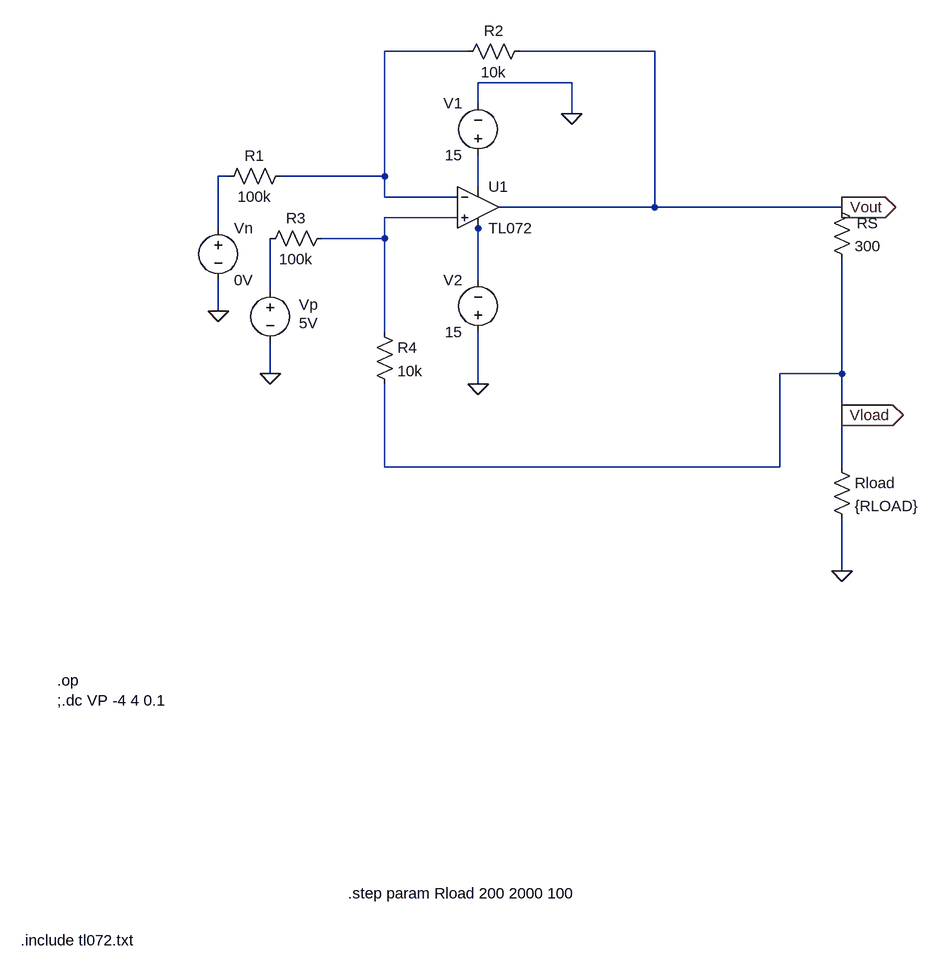
[diagram p0: schematic Tek_projekat.asc]
Tek_projekat.asc, the LTspice schematic file:
Version 4.1
SHEET 1 1220 1176
WIRE 432 -272 304 -272
WIRE 720 -272 512 -272
WIRE 592 -224 448 -224
WIRE 448 -192 448 -224
WIRE 592 -176 592 -224
WIRE 64 -80 48 -80
WIRE 304 -80 304 -272
WIRE 304 -80 144 -80
WIRE 448 -64 448 -112
WIRE 304 -48 304 -80
WIRE 416 -48 304 -48
WIRE 720 -32 720 -272
WIRE 720 -32 480 -32
WIRE 1008 -32 720 -32
WIRE 416 -16 304 -16
WIRE 48 0 48 -80
WIRE 448 0 448 -16
WIRE 304 16 304 -16
WIRE 304 16 208 16
WIRE 448 80 448 0
WIRE 128 96 128 16
WIRE 48 128 48 80
WIRE 304 160 304 16
WIRE 128 224 128 176
WIRE 1008 224 1008 48
WIRE 1008 224 912 224
WIRE 448 240 448 160
WIRE 1008 288 1008 224
WIRE 304 368 304 240
WIRE 912 368 912 224
WIRE 912 368 304 368
WIRE 1008 368 1008 288
WIRE 1008 528 1008 448
FLAG 48 128 0
FLAG 128 224 0
FLAG 1008 528 0
FLAG 1008 -32 Vout
IOPIN 1008 -32 Out
FLAG 592 -176 0
FLAG 448 240 0
FLAG 1008 288 Vload
IOPIN 1008 288 Out
SYMBOL res 160 -96 R90
WINDOW 0 0 56 VBottom 2
WINDOW 3 32 56 VTop 2
SYMATTR InstName R1
SYMATTR Value 100k
SYMATTR SpiceLine tol=1 pwr=0.1
SYMBOL res 224 0 R90
WINDOW 0 0 56 VBottom 2
WINDOW 3 32 56 VTop 2
SYMATTR InstName R3
SYMATTR Value 100k
SYMBOL res 528 -288 R90
WINDOW 0 0 56 VBottom 2
WINDOW 3 32 56 VTop 2
SYMATTR InstName R2
SYMATTR Value 10k
SYMBOL res 288 144 R0
SYMATTR InstName R4
SYMATTR Value 10k
SYMBOL res 992 -48 R0
WINDOW 0 39 40 Left 2
SYMATTR InstName RS
SYMATTR Value 300
SYMBOL res 992 352 R0
SYMATTR InstName Rload
SYMATTR Value {RLOAD}
SYMBOL voltage 128 80 R0
WINDOW 0 44 38 Left 2
WINDOW 3 44 66 Left 2
WINDOW 123 44 94 Left 2
WINDOW 39 0 0 Left 0
SYMATTR InstName Vp
SYMATTR Value 5V
SYMBOL voltage 48 -16 R0
WINDOW 123 0 0 Left 0
WINDOW 39 0 0 Left 0
SYMATTR InstName Vn
SYMATTR Value 0V
SYMBOL voltage 448 -96 R180
WINDOW 0 24 96 Left 2
WINDOW 3 24 16 Left 2
WINDOW 123 0 0 Left 0
WINDOW 39 0 0 Left 0
SYMATTR InstName V1
SYMATTR Value 15
SYMBOL voltage 448 176 R180
WINDOW 0 24 96 Left 2
WINDOW 3 24 16 Left 2
WINDOW 123 0 0 Left 0
WINDOW 39 0 0 Left 0
SYMATTR InstName V2
SYMATTR Value 15
SYMBOL OpAmps\\opamp2 448 -96 R0
SYMATTR InstName U1
SYMATTR Value TL072
TEXT -200 696 Left 2 !.op\n;.dc VP -4 4 0.1
TEXT -256 1096 Left 2 !.include tl072.txt
TEXT 248 1024 Left 2 !.step param Rload 200 2000 100

The netlist it stands for:
* Tek_projekat.asc
R1 N001 N002 100k tol=1 pwr=0.1
R3 N004 N006 100k
R2 Vout N001 10k
R4 N004 Vload 10k
RS Vout Vload 300
Rload Vload 0 {RLOAD}
Vp N006 0 5V
Vn N002 0 0V
V1 N003 0 15
V2 0 N005 15
X§U1 N004 N001 N003 N005 Vout TL072  ; pins In+ In- V+ V- OUT
.op
;.dc VP -4 4 0.1
.include tl072.txt
.step param Rload 200 2000 100
.backanno
.end

* Results of the author's LTspice run, read from the files saved beside the schematic
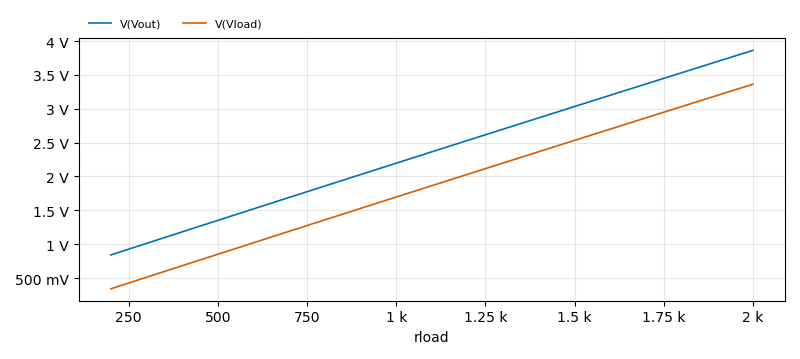
[diagram p1: Operating Point of Tek_projekat.asc, plotted from the saved traces]
* Operating Point, 1 run:
*   V(Vout): 841.8 mV at rload=200 , 3.862 V at rload=2 k, min 841.8 mV, max 3.862 V
*   V(Vload): 341.8 mV at rload=200 , 3.362 V at rload=2 k, min 341.8 mV, max 3.362 V